# Altium schematic sheet 显示面板.SchDoc
size A4
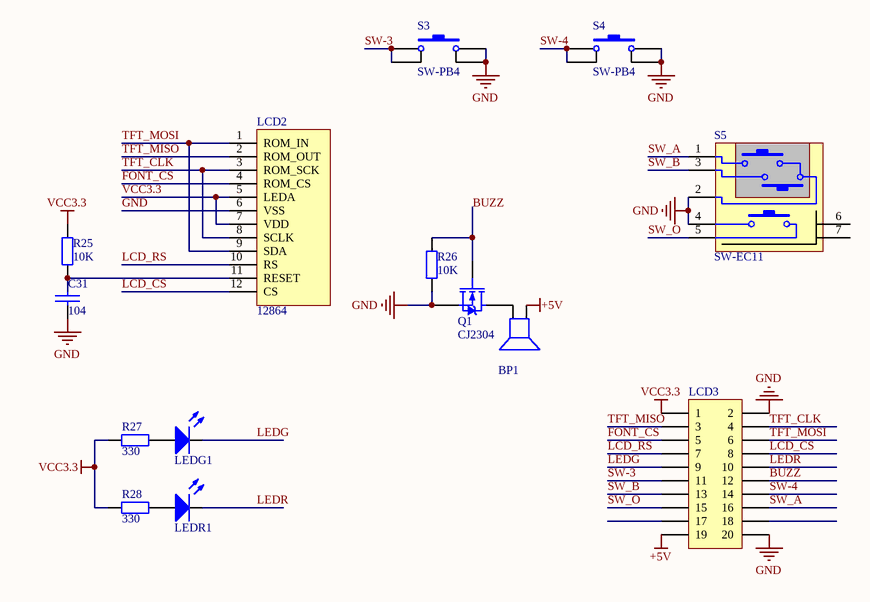
[diagram p0: 显示面板.SchDoc]

## Parts
BP1  BUZZER  [蜂鸣器]  (value not drawn)
C31  104  [0603C]
LCD2  12864  [LCD12864-1.7inch]
LCD3  LCD  [HDR10X2_A1]  (value not drawn)
LEDG1  COLOUR  [LEDφ6]  (value not drawn)
LEDR1  COLOUR  [LEDφ6]  (value not drawn)
Q1  CJ2304  [SOT-23]
R25  value 10K  [0603-1]  (hidden comment: Res1)
R26  value 10K  [0603-1]  (hidden comment: Res1)
R27  value 330  [0603-1]  (hidden comment: Res1)
R28  value 330  [0603-1]  (hidden comment: Res1)
S3  SW-PB4  [SW_PB4_A1]
S4  SW-PB4  [SW_PB4_A1]
S5  SW-EC11  [EC11]

## Nets
+5V: BP1.1(+) LCD3.19
GND: C31.1 LCD2.6(VSS) LCD3.2 LCD3.20 Q1.2(S) R26.1 S3.2 S3.3 S4.2 S4.3 S5.2 S5.4
VCC3.3: LCD2.5(LEDA) LCD2.7(VDD) LCD3.1 R25.2 R27.2 R28.2
BUZZ: LCD3.12 Q1.1(G) R26.2
FONT_CS: LCD2.4(ROM_CS) LCD3.5
LCD_CS: LCD2.12(CS) LCD3.8
LCD_RS: LCD2.10(RS) LCD3.7
LEDG: LCD3.9 LEDG1.2(-)
LEDR: LCD3.10 LEDR1.2(-)
SW-3: LCD3.11 S3.1 S3.4
SW-4: LCD3.14 S4.1 S4.4
SW_A: LCD3.16 S5.1
SW_B: LCD3.13 S5.3
SW_O: LCD3.15 S5.5
TFT_CLK: LCD2.3(ROM_SCK) LCD2.8(SCLK) LCD3.4
TFT_MISO: LCD2.2(ROM_OUT) LCD3.3
TFT_MOSI: LCD2.1(ROM_IN) LCD2.9(SDA) LCD3.6
NetBP1_2: BP1.2(-) Q1.3(D)
NetC31_2: C31.2 LCD2.11(RESET) R25.1
NetLEDG1_1: LEDG1.1(+) R27.1
NetLEDR1_1: LEDR1.1(+) R28.1

Not connected (* = marked no-connect by the designer): LCD3 17 18; S5 6 7

## Library data of the parts
BP1 = BUZZER: 蜂鸣器
C31 = CAP X: 安规电容
LCD2 = LCD12864串口屏: 1.7寸SPI12864屏; 链接: https://item.taobao.com/item.htm?id=12879087349&ali_refid=a3_430582_1006:1103967305:N:12864:66eadc08ff72364ec7fad7a9c6eab1e1&ali_trackid=1_66eadc08ff72364ec7fad7a9c6eab1e1&spm=a230r.1.14.3#detail
LCD3 = Header 10X2: Header, 10-Pin; LatestRevisionDate: 17-Jul-2002; LatestRevisionNote: Re-released for DXP Platform.; Publisher: Altium Limited
LEDG1 LEDR1 = ledφ6
Q1 = MOSFET-N: N-Channel MOSFET; PackageDocument: 1995/1996; Published: 8-Jun-2000; LatestRevisionDate: 17-Jul-2002; LatestRevisionNote: Re-released for DXP Platform.; PackageReference: E3; Publisher: Altium Limited
R25-R28 = Res1: 贴片电阻; Published: 8-Jun-2000; LatestRevisionDate: 17-Jul-2002; LatestRevisionNote: Re-released for DXP Platform.; PackageReference: AXIAL-0.4; Publisher: Altium Limited
S3 S4 = SW-PB4: 微动开关; Published: 24-Mar-1999; LatestRevisionDate: 17-Jul-2002; LatestRevisionNote: Re-released for DXP Platform.; PackageReference: SPST-2; Publisher: Altium Limited
S5 = SW-EC11: 旋转编码开关; Published: 24-Mar-1999; LatestRevisionDate: 17-Jul-2002; LatestRevisionNote: Re-released for DXP Platform.; PackageReference: SPST-2; Publisher: Altium Limited